# EAGLE design jack_countdown (EAGLE 5.09)
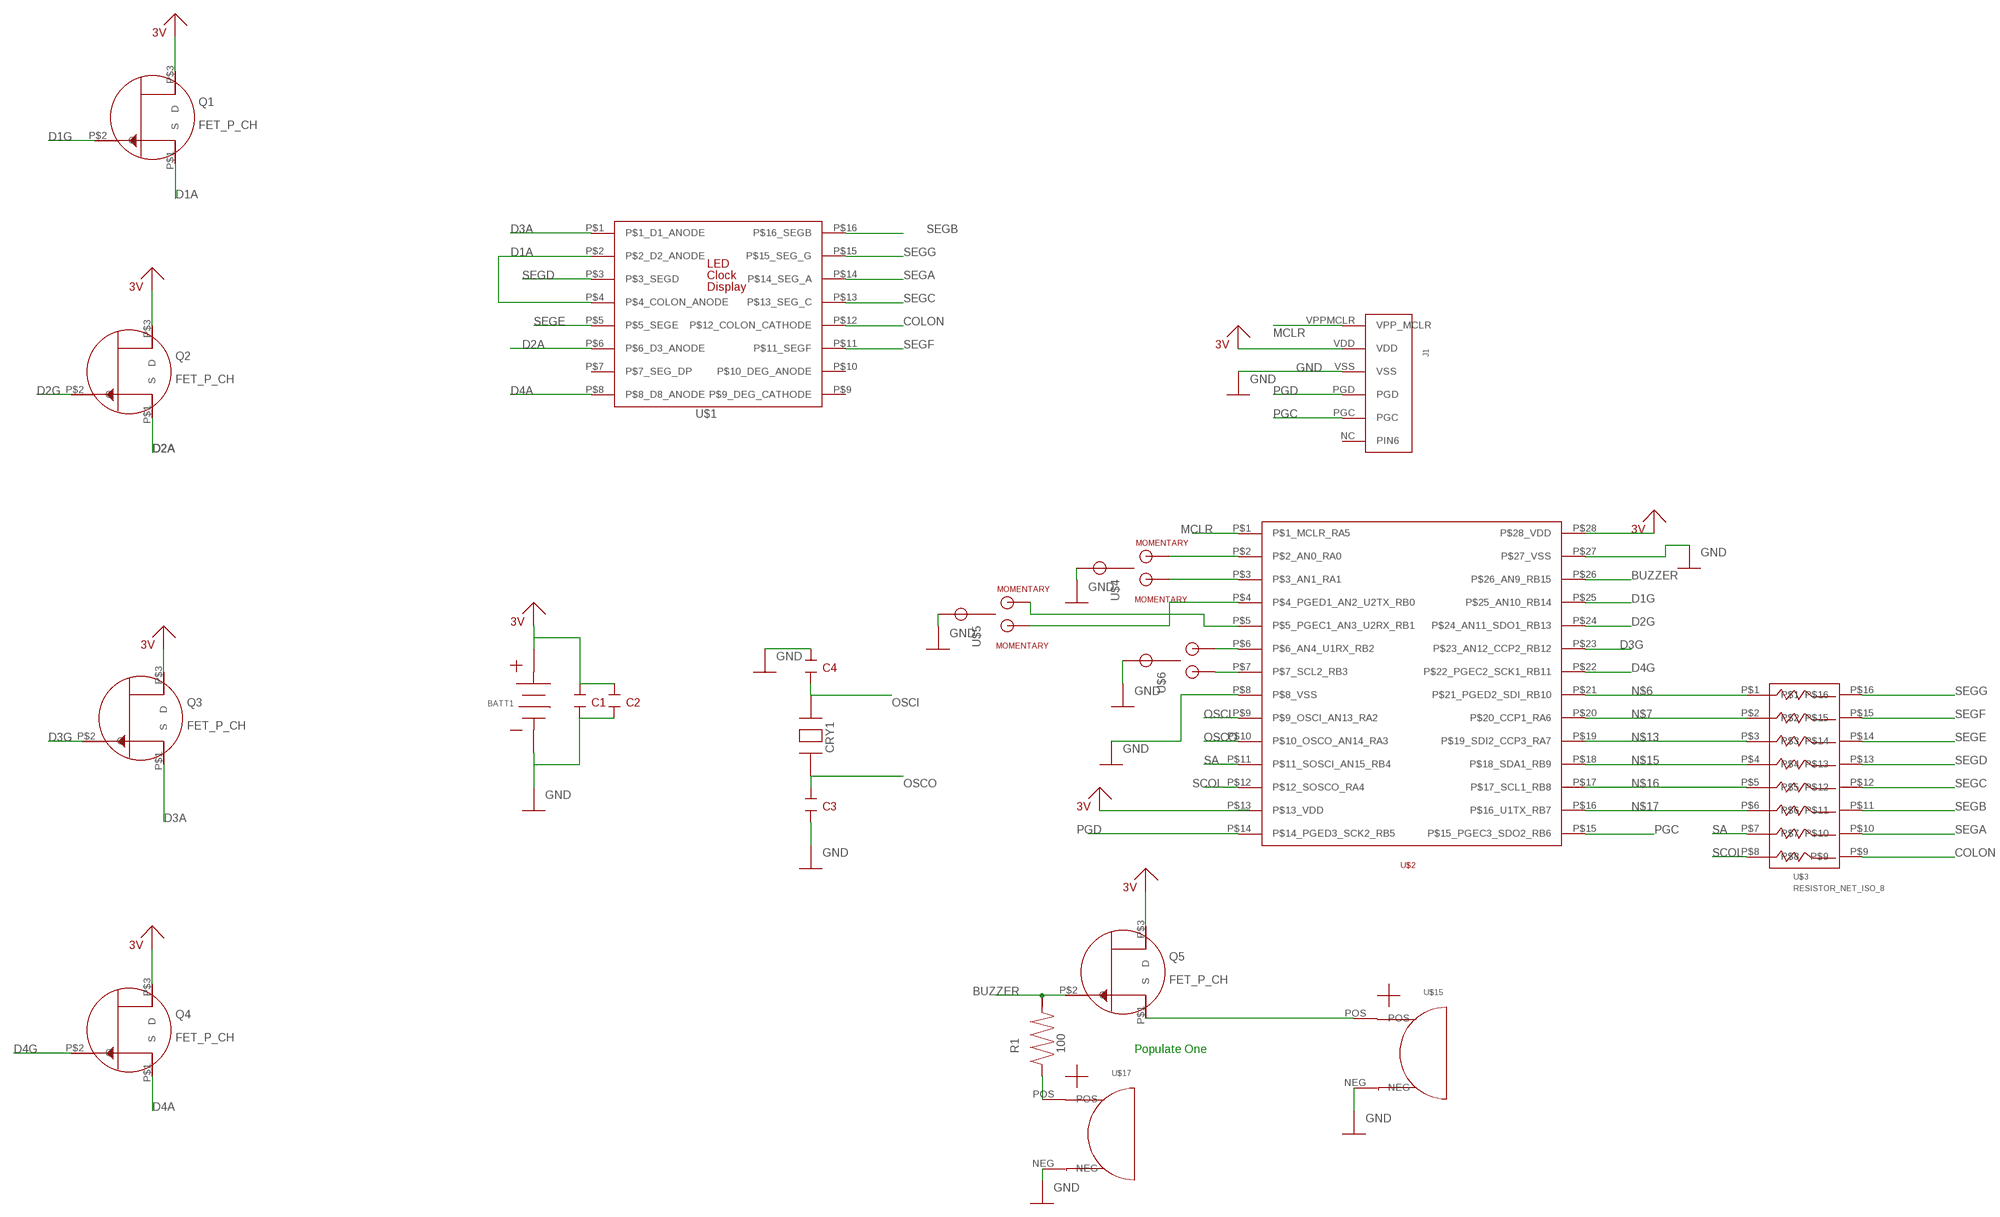
[diagram p0: schematic, sheet 1]

## Parts
BATT1  BATTERYAAAX2  [BATT_AAAX2_2468K-ND]
C1  CAPACITOR18PF_CERAMIC_DEA1X3A180JC1B  [1X02_5MM]
C2  CAPACITOR18PF_CERAMIC_DEA1X3A180JC1B  [1X02_5MM]
C3  CAPACITOR18PF_CERAMIC_DEA1X3A180JC1B  [1X02_5MM]
C4  CAPACITOR18PF_CERAMIC_DEA1X3A180JC1B  [1X02_5MM]
CRY1  CRYSTAL.1HEADER  [1X02]
J1  PICKIT2HEADERARROWONLY  [PICKIT2HEADER_ARROW]
Q1  FET_P_CH  [TO-92]
Q2  FET_P_CH  [TO-92]
Q3  FET_P_CH  [TO-92]
Q4  FET_P_CH  [TO-92]
Q5  FET_P_CH  [TO-92]
R1  100  RESISTOR1/8W  [R_.125W_THROUGHHOLE]
U$1  LED_DISPLAY_CLOCK_1080-1182-ND  [LED_DISPLAY_CLOCK_1080-1182-ND]
U$2  24FXXKL402DIP  [SPDIP28_300]
U$3  RESISTOR_NET_ISO_8  [DIP16_300]
U$4  SWITCH_SPDT_MOMENTARYEG2389-ND  [SW_SPDT_EG2389-ND]
U$5  SWITCH_SPDT_MOMENTARYEG2389-ND  [SW_SPDT_EG2389-ND]
U$6  SWITCH_SPDTEG2352-ND  [SW_SPDT_EG2389-ND]
U$15  BUZZER  [BUZZER_CS_3603]
U$17  BUZZERPIEZO  [PIEZO_445-2525-3-ND]

## Nets
3V: BATT1.POS C1.P$1 C2.P$1 J1.VDD Q1.P$3(D) Q2.P$3(D) Q3.P$3(D) Q4.P$3(D) Q5.P$3(D) U$2.P$13(P$13_VDD) U$2.P$28(P$28_VDD)
BUZZER: Q5.P$2(G) R1.P$2 U$2.P$26(P$26_AN9_RB15)
COLON: U$1.P$12(P$12_COLON_CATHODE) U$3.P$9
D1A: Q1.P$1(S) U$1.P$2(P$2_D2_ANODE) U$1.P$4(P$4_COLON_ANODE)
D1G: Q1.P$2(G) U$2.P$25(P$25_AN10_RB14)
D2A: Q2.P$1(S) U$1.P$6(P$6_D3_ANODE)
D2G: Q2.P$2(G) U$2.P$24(P$24_AN11_SDO1_RB13)
D3A: Q3.P$1(S) U$1.P$1(P$1_D1_ANODE)
D3G: Q3.P$2(G) U$2.P$23(P$23_AN12_CCP2_RB12)
D4A: Q4.P$1(S) U$1.P$8(P$8_D8_ANODE)
D4G: Q4.P$2(G) U$2.P$22(P$22_PGEC2_SCK1_RB11)
GND: BATT1.NEG C1.P$2 C2.P$2 C3.P$2 C4.P$1 J1.VSS U$2.P$8(P$8_VSS) U$2.P$27(P$27_VSS) U$4.P$2 U$5.P$2 U$6.P$2 U$15.NEG U$17.NEG
MCLR: J1.VPPMCLR(VPP_MCLR) U$2.P$1(P$1_MCLR_RA5)
N$1: R1.P$1 U$17.POS
N$2: U$2.P$7(P$7_SCL2_RB3) U$6.P$3
N$3: U$2.P$4(P$4_PGED1_AN2_U2TX_RB0) U$5.P$3
N$4: U$2.P$5(P$5_PGEC1_AN3_U2RX_RB1) U$5.P$1
N$6: U$2.P$21(P$21_PGED2_SDI_RB10) U$3.P$1
N$7: U$2.P$20(P$20_CCP1_RA6) U$3.P$2
N$8: U$2.P$6(P$6_AN4_U1RX_RB2) U$6.P$1
N$11: U$2.P$3(P$3_AN1_RA1) U$4.P$3
N$12: U$2.P$2(P$2_AN0_RA0) U$4.P$1
N$13: U$2.P$19(P$19_SDI2_CCP3_RA7) U$3.P$3
N$14: Q5.P$1(S) U$15.POS
N$15: U$2.P$18(P$18_SDA1_RB9) U$3.P$4
N$16: U$2.P$17(P$17_SCL1_RB8) U$3.P$5
N$17: U$2.P$16(P$16_U1TX_RB7) U$3.P$6
OSCI: C4.P$2 CRY1.P$2 U$2.P$9(P$9_OSCI_AN13_RA2)
OSCO: C3.P$1 CRY1.P$1 U$2.P$10(P$10_OSCO_AN14_RA3)
PGC: J1.PGC U$2.P$15(P$15_PGEC3_SDO2_RB6)
PGD: J1.PGD U$2.P$14(P$14_PGED3_SCK2_RB5)
SA: U$2.P$11(P$11_SOSCI_AN15_RB4) U$3.P$7
SCOL: U$2.P$12(P$12_SOSCO_RA4) U$3.P$8
SEGA: U$1.P$14(P$14_SEG_A) U$3.P$10
SEGB: U$1.P$16(P$16_SEGB) U$3.P$11
SEGC: U$1.P$13(P$13_SEG_C) U$3.P$12
SEGD: U$1.P$3(P$3_SEGD) U$3.P$13
SEGE: U$1.P$5(P$5_SEGE) U$3.P$14
SEGF: U$1.P$11(P$11_SEGF) U$3.P$15
SEGG: U$1.P$15(P$15_SEG_G) U$3.P$16
Unconnected: J1.NC(PIN6) U$1.P$7(P$7_SEG_DP) U$1.P$9(P$9_DEG_CATHODE) U$1.P$10(P$10_DEG_ANODE)

## Notes on the sheet
- Populate One

## Library data of the parts
BATT1 = custom:BATTERY
C1-C4 = custom:CAPACITOR
CRY1 = custom:CRYSTAL
J1 = custom:PICKIT2HEADER
Q1-Q5 = custom:FET_P_CH
R1 = custom:RESISTOR
U$1 = custom:LED_DISPLAY_CLOCK_1080-1182-ND
U$2 = custom:24FXXKL402
U$3 = custom:RESISTOR_NET_ISO_8
U$4 U$5 = custom:SWITCH_SPDT_MOMENTARY
U$6 = custom:SWITCH_SPDT
U$15 U$17 = custom:BUZZER

## Board
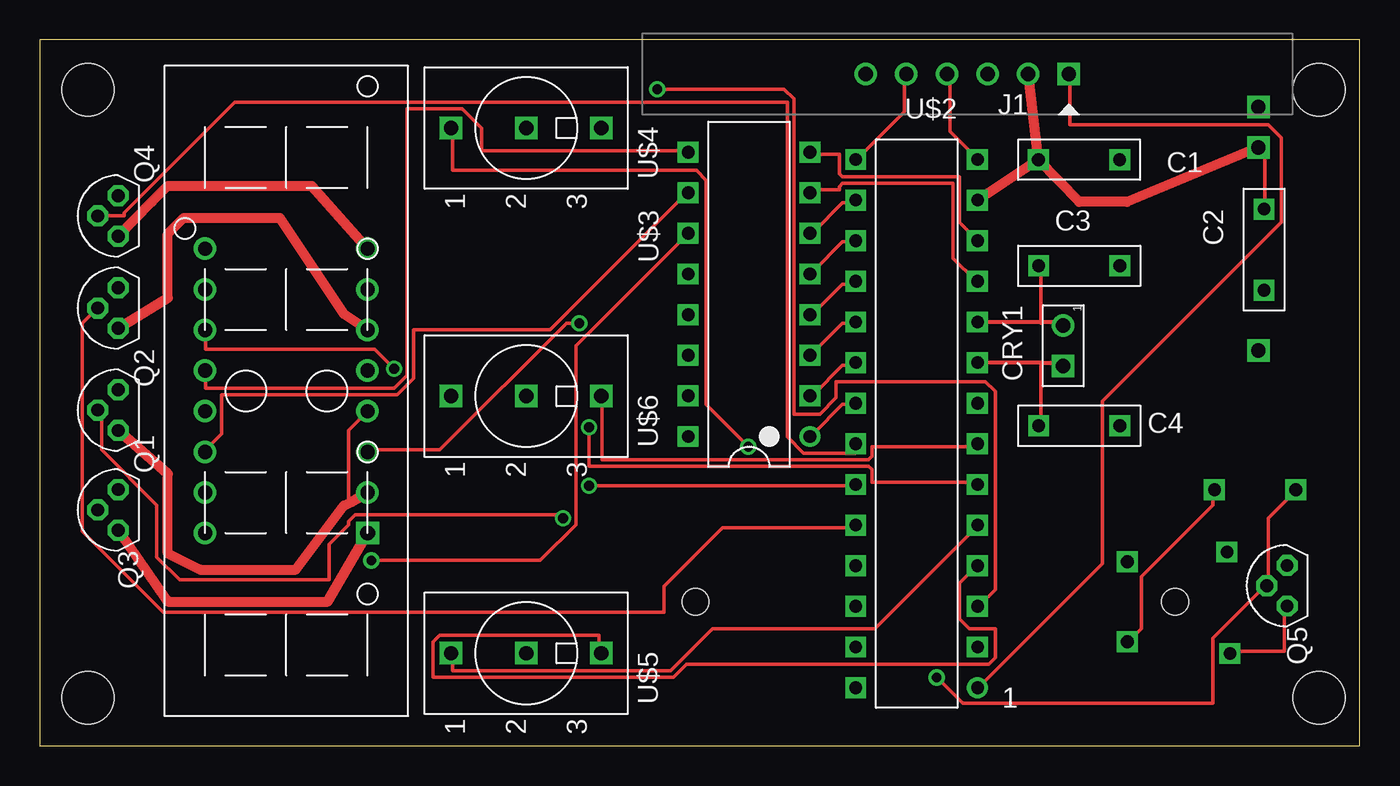
[diagram p1: board, top side]
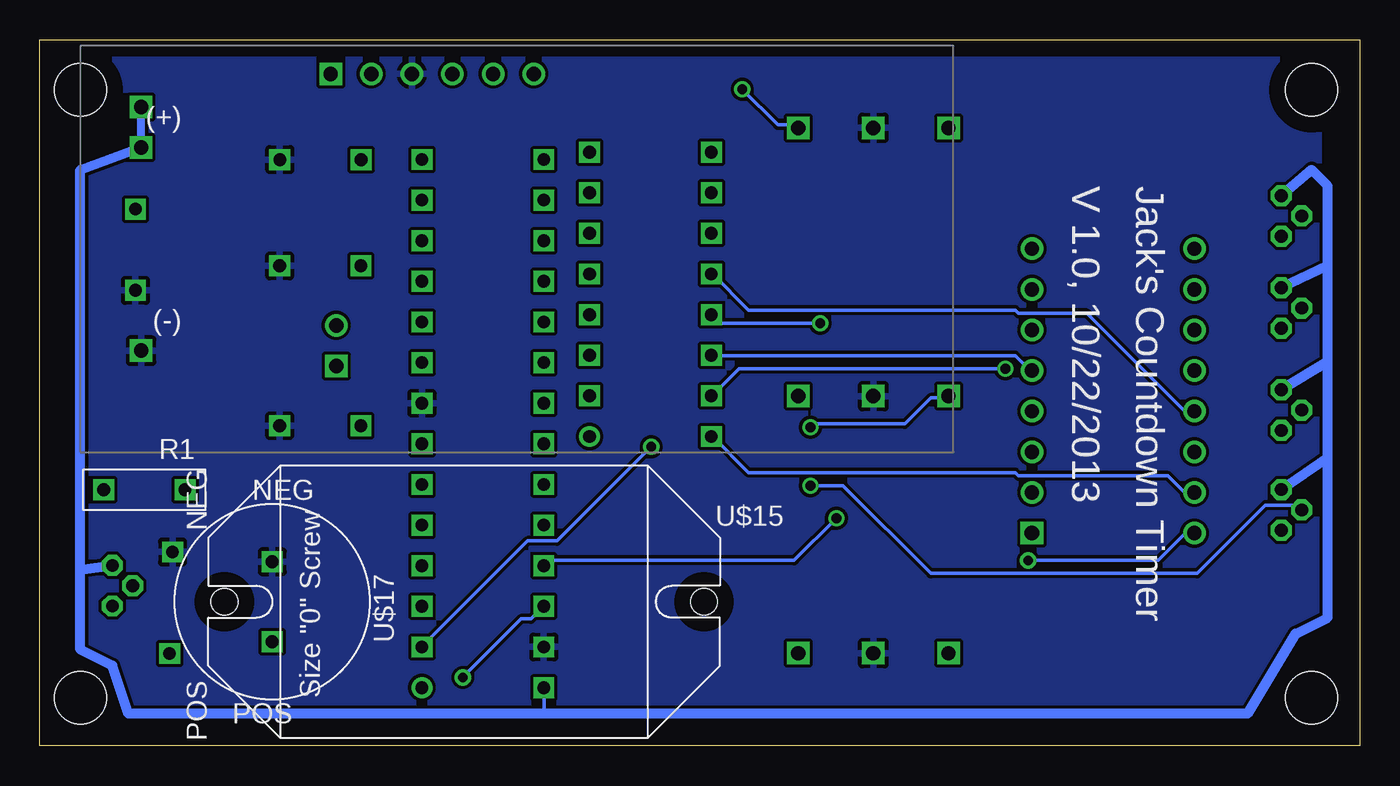
[diagram p2: board, bottom side, seen from below]

Size 82.53 x 44.12 mm. Coordinates in mm from the lower left corner, seen from the top.
Outline: 0,0 82.53,0 82.53,44.12 0,44.12 0,0
Copper layers (1*16): Top 0.035mm / dielectric 1.5mm / Bottom 0.035mm
Design rules "default *": minimum track width 8mil, minimum drill 24mil, track to track 8mil, track to pad 8mil, pad to pad 8mil, via to via 8mil, smd to smd 8mil, copper to edge 40mil, drill to drill 8mil, minimum pad ring 10mil, minimum via ring 8mil, stop-mask expansion 4mil, vias tented up to drill 0mil, thermal gap 10mil
Holes 3.26 mm at 3,41 3,3 80,3 80,41

### Footprints (pad centres in the part's own frame; a part is rotated, then mirrored left to right if it is on the bottom)
BATT_AAAX2_2468K-ND = drill 0.9 square: NEG 0,6.35; POS 0,-6.35; POS2 0,-8.89
1X02_5MM = drill 0.8 square: P$1 -2.54,0; P$2 2.54,0
1X02 = drill 0.9 round: P$1 -1.27,0 | drill 0.9 square: P$2 1.27,0
PICKIT2HEADER_ARROW = drill 0.9 round: NC 6.35,0; PGC 3.81,0; PGD 1.27,0; VDD -3.81,0; VSS -1.27,0 | drill 0.9 square: VPPMCLR -6.35,0
TO-92 = drill 0.8 octagon: P$1 1.27,0; P$2 0,-1.27; P$3 -1.27,0
R_.125W_THROUGHHOLE = drill 0.8 square: P$1 -2.54,0; P$2 2.54,0
LED_DISPLAY_CLOCK_1080-1182-ND = drill 0.914 square: P$1 -8.89,-5.08 | drill 0.9 round: P$2 -6.35,-5.08; P$3 -3.81,-5.08; P$4 -1.27,-5.08; P$5 1.27,-5.08; P$6 3.81,-5.08; P$7 6.35,-5.08; P$8 8.89,-5.08; P$9 8.89,5.08; P$10 6.35,5.08; P$11 3.81,5.08; P$12 1.27,5.08; P$13 -1.27,5.08; P$14 -3.81,5.08; P$15 -6.35,5.08; P$16 -8.89,5.08
SPDIP28_300 = drill 0.8 round: P$1 -3.81,16.51 | drill 0.8 square: P$2 -3.81,13.97; P$3 -3.81,11.43; P$4 -3.81,8.89; P$5 -3.81,6.35; P$6 -3.81,3.81; P$7 -3.81,1.27; P$8 -3.81,-1.27; P$9 -3.81,-3.81; P$10 -3.81,-6.35; P$11 -3.81,-8.89; P$12 -3.81,-11.43; P$13 -3.81,-13.97; P$14 -3.81,-16.51; P$15 3.81,-16.51; P$16 3.81,-13.97; P$17 3.81,-11.43; P$18 3.81,-8.89; P$19 3.81,-6.35; P$20 3.81,-3.81; P$21 3.81,-1.27; P$22 3.81,1.27; P$23 3.81,3.81; P$24 3.81,6.35; P$25 3.81,8.89; P$26 3.81,11.43; P$27 3.81,13.97; P$28 3.81,16.51
DIP16_300 = drill 0.8 round: P$1 -8.89,-3.81 | drill 0.8 square: P$2 -6.35,-3.81; P$3 -3.81,-3.81; P$4 -1.27,-3.81; P$5 1.27,-3.81; P$6 3.81,-3.81; P$7 6.35,-3.81; P$8 8.89,-3.81; P$9 8.89,3.81; P$10 6.35,3.81; P$11 3.81,3.81; P$12 1.27,3.81; P$13 -1.27,3.81; P$14 -3.81,3.81; P$15 -6.35,3.81; P$16 -8.89,3.81
SW_SPDT_EG2389-ND = drill 0.9 square: P$1 0,4.699; P$2 0,0; P$3 0,-4.699
BUZZER_CS_3603 = drill 0.8 square: NEG 3.11,18.24; POS -3.24,18.43 | hole 1.676: 0,15; 0,-15
PIEZO_445-2525-3-ND = drill 0.8 square: NEG 2.5,0; POS -2.5,0

### Placement (x,y rotation side)
BATT1  76.2,31.05 180 bottom
C1  64.99,36.64 0 top
C2  76.56,31.01 270 top
C3  65,30 0 top
C4  65,20 180 top
CRY1  64,25 270 top
J1  58,42 180 top
Q1  4.89,20.98 270 top
Q2  4.89,27.36 270 top
Q3  4.89,14.74 270 top
Q4  4.89,33.12 270 top
Q5  78,10 270 top
R1  76,16 180 bottom
U$1  15.41,22.18 90 top
U$2  54.83,20.14 180 top
U$3  44.35,28.22 90 top
U$4  30.41,38.62 90 top
U$5  30.41,5.78 90 top
U$6  30.41,21.85 90 top
U$15  56,9 90 bottom
U$17  68,9 90 bottom

### Tracks (layer width: path | path; a pad name or v marks a point on that pad's centre or on a via)
3V
  Top 0.203: BATT1.POS 76.2,37.59 76.4,37.8 76.61,37.8 76.61,33.73 C2.P$1
  Top 0.61: BATT1.POS 68,34 65,34 C1.P$1 | C1.P$1 U$2.P$13 | C1.P$1 J1.VDD
  Bottom 0.203: U$2.P$28 51,3.45 51,2
  Bottom 0.61: BATT1.POS 80,36 80,11 | 80,11 80,6 78,5 77,2 51,2 7,2 4,7 2,8 2,18 | 2,18 2,24 | 2,24 2,30 | 2,30 2,35 3,36 Q4.P$3 | 80,11 Q5.P$3 | 2,30 Q2.P$3 | 2,18 Q3.P$3 | 2,24 Q1.P$3
BUZZER  (via drill 0.61)
  Top 0.203: v56.08,4.27 57.71,2.64 73.36,2.64 73.36,6.71 76.61,9.96 Q5.P$2 76.81,10.16 76.81,14.22 78.44,15.85 R1.P$2
  Bottom 0.203: v56.08,4.27 52.43,7.92 51.82,7.92 51.21,8.53 U$2.P$26
COLON
  Top 0.203: U$3.P$9 40.44,37.19 27.64,37.19 27.64,38.61 26.42,39.83 22.96,39.83 22.96,23.16 22.15,22.35 10.36,22.35 10.36,23.37 U$1.P$12
D1A
  Top 0.203: U$1.P$4 20.32,20.73 19.3,19.71 19.3,15.44 19.42,15.23
  Top 0.61: Q1.P$1 8,17 8,12 10,11 16,11 19,15 19.42,15.23 U$1.P$2
D1G  (via drill 0.61)
  Top 0.203: v32.72,14.22 32.72,14.43 19.71,14.43 19.3,14.02 19.3,13.82 18.09,12.6 18.09,10.36 8.74,10.36 7.32,11.79 7.32,15.04 3.86,18.49 3.86,20.73 3.66,20.93 Q1.P$2
  Bottom 0.203: v32.72,14.22 35.36,11.58 50.8,11.58 51,11.38 U$2.P$25
D2A
  Top 0.61: Q2.P$1 8,28 8,32 9,33 15,33 19,27 U$1.P$6
D2G
  Top 0.203: Q2.P$2 3.45,27.23 2.64,26.42 2.64,13.41 7.72,8.33 39.01,8.33 39.01,9.96 42.67,13.61 51,13.61 U$2.P$24
D3A
  Top 0.61: Q3.P$1 8,9 18,9 U$1.P$1
D3G  (via drill 0.61)
  Top 0.203: v34.34,16.26 51,16.26 U$2.P$23
  Bottom 0.203: v34.34,16.26 32.31,16.26 26.82,10.77 10.16,10.77 5.89,15.04 3.86,15.04 3.66,14.83 Q3.P$2
D4A
  Top 0.61: Q4.P$1 7,34 8,35 17,35 U$1.P$8
D4G
  Top 0.203: Q4.P$2 3.66,33.12 5.28,33.12 5.28,33.33 12.19,40.23 46.74,40.23 46.74,19.3 47.75,18.29 51,18.29 51,18.69 U$2.P$22
GND
  pour Bottom: 2.54,43.18 80.01,43.18 80.01,2.54 2.54,2.54
MCLR
  Top 0.203: U$2.P$1 58.73,3.66 66.45,11.38 66.45,21.54 77.62,32.72 77.62,38 76.81,38.81 64.41,38.81 64.41,41.86 J1.VPPMCLR
N$1
  Top 0.203: U$17.POS 68.07,6.5 68.89,7.32 68.89,10.57 73.36,15.04 73.36,15.85 R1.P$1
N$2
  Top 0.203: U$2.P$7 58.52,18.69 52.02,18.69 52.02,18.09 51.82,17.88 35.15,17.88 35.15,21.74 U$6.P$3
N$3
  Top 0.203: U$2.P$4 58.52,11.18 57.51,10.16 57.51,7.92 58.12,7.32 59.74,7.32 59.74,5.49 59.33,5.08 40.44,5.08 39.62,4.27 24.59,4.27 24.59,6.5 24.99,6.91 34.95,6.91 34.95,5.89 U$5.P$3
N$4
  Top 0.203: U$2.P$5 58.52,13.61 52.22,7.32 42.06,7.32 39.42,4.67 25.81,4.67 25.81,5.69 U$5.P$1
N$6
  Top 0.203: U$3.P$1 48.36,19.51 50.19,21.34 51,21.34 U$2.P$21
N$7
  Top 0.203: U$3.P$2 48.36,21.95 50.19,23.77 51,23.77 U$2.P$20
N$8  (via drill 0.61)
  Top 0.203: v34.34,19.91 34.34,17.48 51.82,17.48 52.02,17.27 52.02,16.46 58.52,16.46 U$2.P$6
  Bottom 0.203: v34.34,19.91 34.14,20.12 28.45,20.12 26.82,21.74 25.81,21.74 U$6.P$1
N$11  (via drill 0.61)
  Top 0.203: v38.61,41.05 46.53,41.05 47.14,40.44 47.14,20.73 48.77,20.73 49.78,21.74 49.78,22.76 59.13,22.76 59.74,22.15 59.74,9.75 58.73,8.74 U$2.P$3
  Bottom 0.203: v38.61,41.05 36.37,38.81 35.15,38.81 U$4.P$3
N$12  (via drill 0.61)
  Top 0.203: v44.3,18.69 41.66,21.34 41.66,35.36 41.05,35.97 25.81,35.97 25.81,38.61 U$4.P$1
  Bottom 0.203: v44.3,18.69 50.19,12.8 52.02,12.8 58.52,6.3 U$2.P$2
N$13
  Top 0.203: U$3.P$3 48.36,24.59 50.19,26.42 51,26.42 U$2.P$19
N$14
  Top 0.203: U$15.POS 74.57,5.89 77.83,5.89 77.83,8.53 Q5.P$1
N$15
  Top 0.203: U$3.P$4 48.36,27.03 50.19,28.85 51,28.85 U$2.P$18
N$16
  Top 0.203: U$3.P$5 48.36,29.67 50.19,31.5 51,31.5 U$2.P$17
N$17
  Top 0.203: U$3.P$6 48.36,32.11 50.19,33.93 51,33.93 U$2.P$16
OSCI
  Top 0.203: C4.P$2 62.59,20.12 62.59,23.95 62.59,23.98
  Top 0.254: U$2.P$9 62.59,23.95 64,23.95 CRY1.P$2
OSCO
  Top 0.203: C3.P$1 62.59,29.87 62.59,26.49 62.59,26.42
  Top 0.254: U$2.P$10 62.59,26.49 64,26.49 CRY1.P$1
PGC
  Top 0.203: U$2.P$15 51.21,36.78 54.05,39.62 54.05,41.86 J1.PGC
PGD
  Top 0.203: U$2.P$14 58.52,36.78 56.9,38.41 56.9,41.86 J1.PGD
SA
  Top 0.203: U$3.P$7 48.36,34.75 49.99,34.75 49.99,34.95 50.19,35.15 57.1,35.15 57.1,30.48 58.52,29.06 U$2.P$11
SCOL
  Top 0.203: U$3.P$8 48.36,36.98 49.99,36.98 49.99,35.76 50.19,35.56 57.51,35.56 57.51,32.72 58.52,31.7 U$2.P$12
SEGA
  Top 0.203: U$3.P$10 40.44,34.54 31.9,26.01 23.37,26.01 23.37,22.96 22.35,21.95 11.38,21.95 11.38,19.51 10.36,18.49 U$1.P$14
SEGB  (via drill 0.61)
  Top 0.203: v20.73,11.58 31.29,11.58 33.53,13.82 33.53,24.99 40.44,31.9 U$3.P$11
  Bottom 0.203: v20.73,11.58 12.6,11.58 10.97,13.21 10.36,13.21 U$1.P$16
SEGC
  Bottom 0.203: U$3.P$12 40.44,29.46 38.2,27.23 21.54,27.23 21.34,27.03 17.07,27.03 10.97,20.93 10.36,20.93 U$1.P$13
SEGD  (via drill 0.61)
  Top 0.203: v33.73,26.42 32.92,26.42 24.99,18.49 20.52,18.49 U$1.P$3
  Bottom 0.203: v33.73,26.42 40.03,26.42 40.44,26.82 U$3.P$13
SEGE
  Bottom 0.203: U$3.P$14 40.44,24.38 21.54,24.38 20.73,23.57 20.52,23.57 U$1.P$5
SEGF  (via drill 0.61)
  Top 0.203: v22.15,23.57 20.93,24.79 10.36,24.79 10.36,25.81 U$1.P$11
  Bottom 0.203: v22.15,23.57 38.81,23.57 40.44,21.95 U$3.P$15
SEGG
  Bottom 0.203: U$3.P$16 40.44,19.3 38.2,17.07 21.54,17.07 21.34,16.87 11.99,16.87 10.97,15.85 10.36,15.85 U$1.P$15

### Text on the board
bPlace: Jack's Countdown Timer | V 1.0, 10/22/2013